# Altium schematic sheet QUTMS_CMU_type2_1_1.SchDoc
size B; DrawnBy: TTR
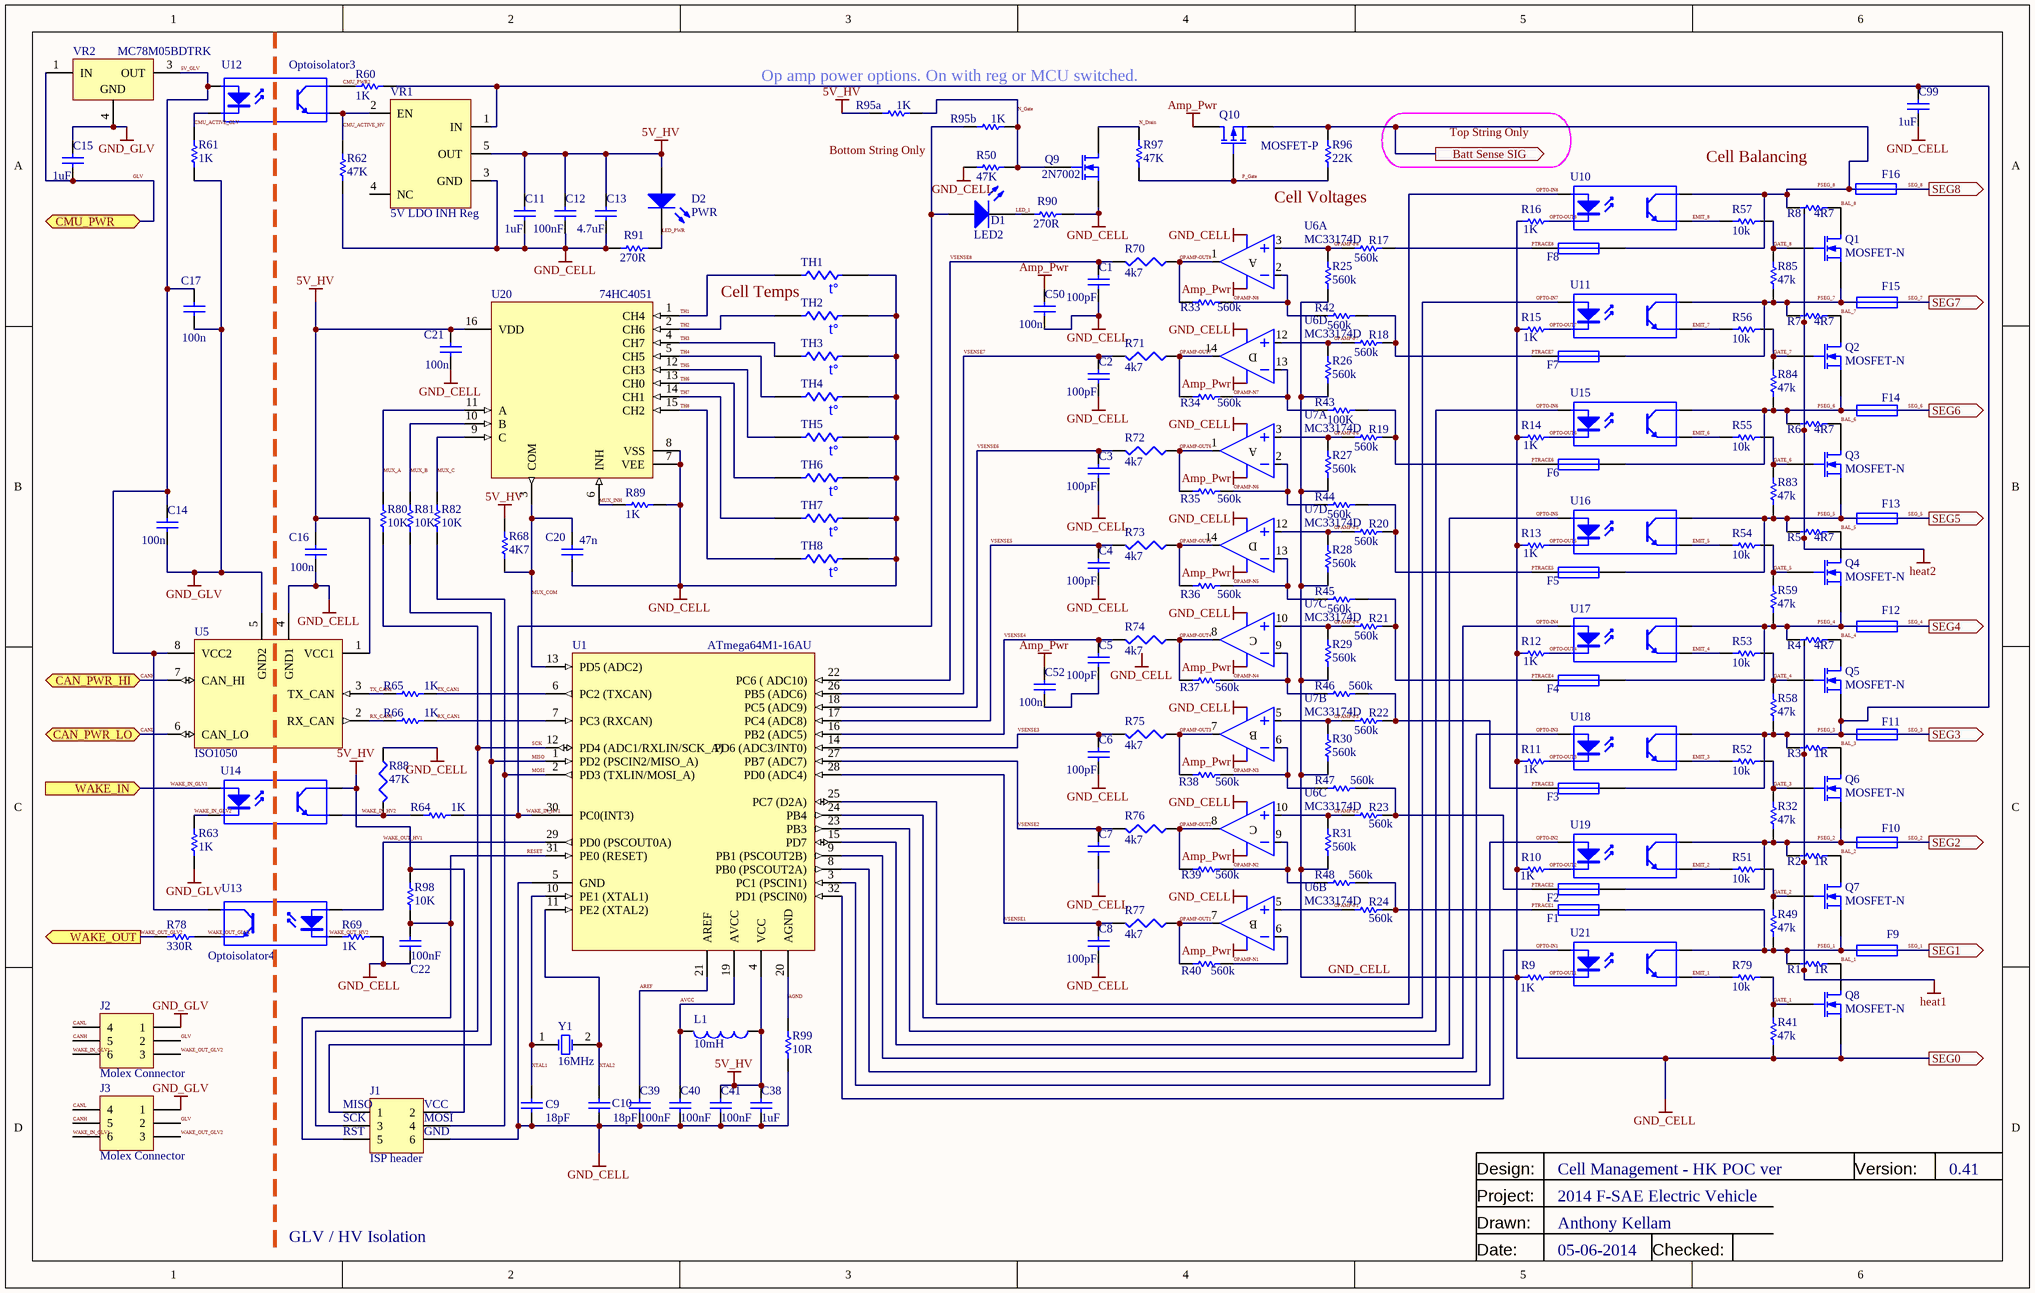
[diagram p0: QUTMS_CMU_type2_1_1.SchDoc]

## Parts
C1  100pF  [1608[0603]]
C2  100pF  [1608[0603]]
C3  100pF  [1608[0603]]
C4  100pF  [1608[0603]]
C5  100pF  [1608[0603]]
C6  100pF  [1608[0603]]
C7  100pF  [1608[0603]]  (value not drawn)
C8  100pF  [1608[0603]]
C9  18pF  [1608[0603]]
C10  18pF  [1608[0603]]
C11  1uF  [1608[0603]]
C12  100nF  [1608[0603]]
C13  4.7uF  [1608[0603]]
C14  value 100n  [1608[0603]]  (hidden comment: 100nF)
C15  value 1uF  [1608[0603]]  (hidden comment: 0603)
C16  value 100n  [1608[0603]]  (hidden comment: 100nF)
C17  value 100n  [1608[0603]]  (hidden comment: 100nF)
C20  value 47n  [1608[0603]]  (hidden comment: 0603)
C21  value 100n  [1608[0603]]  (hidden comment: 100nF)
C22  100nF  [1608[0603]]
C38  1uF  [1608[0603]]
C39  100nF  [1608[0603]]
C40  100nF  [1608[0603]]
C41  100nF  [1608[0603]]
C50  value 100n  [1608[0603]]  (hidden comment: 100nF)
C52  value 100n  [1608[0603]]  (hidden comment: 100nF)
C99  1uF  [1608[0603]]
D1  LED2  [2012[0805]_Res]
D2  PWR  [2012[0805]_Res]
F1  Fuse 1  [3216[1206]]  (value not drawn)
F2  Fuse 1  [3216[1206]]  (value not drawn)
F3  Fuse 1  [3216[1206]]  (value not drawn)
F4  Fuse 1  [3216[1206]]  (value not drawn)
F5  Fuse 1  [3216[1206]]  (value not drawn)
F6  Fuse 1  [3216[1206]]  (value not drawn)
F7  Fuse 1  [3216[1206]]  (value not drawn)
F8  Fuse 1  [3216[1206]]  (value not drawn)
F9  Fuse 1  [6426[2410]_Fuse]  (value not drawn)
F10  Fuse 1  [6426[2410]_Fuse]  (value not drawn)
F11  Fuse 1  [6426[2410]_Fuse]  (value not drawn)
F12  Fuse 1  [6426[2410]_Fuse]  (value not drawn)
F13  Fuse 1  [6426[2410]_Fuse]  (value not drawn)
F14  Fuse 1  [6426[2410]_Fuse]  (value not drawn)
F15  Fuse 1  [6426[2410]_Fuse]  (value not drawn)
F16  Fuse 1  [6426[2410]_Fuse]  (value not drawn)
J1  ISP header  [ISP Header]
J2  Molex Connector  [MOLEX_6H_2]
J3  Molex Connector  [MOLEX_6H_1]
L1  value 10mH  [2012[0805]_IND]  (hidden comment: 10uH)
Q1  MOSFET-N  [D2PAK_L]
Q2  MOSFET-N  [D2PAK_L]
Q3  MOSFET-N  [D2PAK_L]
Q4  MOSFET-N  [D2PAK_L]
Q5  MOSFET-N  [D2PAK_L]
Q6  MOSFET-N  [D2PAK_L]
Q7  MOSFET-N  [D2PAK_L]
Q8  MOSFET-N  [D2PAK_L]
Q9  2N7002  [SOT23_N]
Q10  MOSFET-P  [SOT23_N]
R1  value 1R  [D2PAK_N]  (hidden comment: 4R7)
R2  value 1R  [D2PAK_N]  (hidden comment: 4R7)
R3  value 1R  [D2PAK_N]  (hidden comment: 4R7)
R4  4R7  [D2PAK_N]
R5  4R7  [D2PAK_N]
R6  4R7  [D2PAK_N]
R7  4R7  [D2PAK_N]
R8  4R7  [D2PAK_N]
R9  1k  [2012[0805]_Res]
R10  1k  [2012[0805]_Res]
R11  1k  [2012[0805]_Res]
R12  1k  [2012[0805]_Res]
R13  1k  [2012[0805]_Res]
R14  1k  [2012[0805]_Res]
R15  1k  [2012[0805]_Res]
R16  1k  [2012[0805]_Res]
R17  560k  [2012[0805]_Res]
R18  560k  [2012[0805]_Res]
R19  560k  [2012[0805]_Res]
R20  560k  [2012[0805]_Res]
R21  560k  [2012[0805]_Res]
R22  560k  [2012[0805]_Res]
R23  560k  [2012[0805]_Res]
R24  560k  [2012[0805]_Res]
R25  560k  [2012[0805]_Res]
R26  560k  [2012[0805]_Res]
R27  560k  [2012[0805]_Res]
R28  560k  [2012[0805]_Res]
R29  560k  [2012[0805]_Res]
R30  560k  [2012[0805]_Res]
R31  560k  [2012[0805]_Res]
R32  47k  [2012[0805]_Res]
R33  560k  [2012[0805]_Res]
R34  560k  [2012[0805]_Res]
R35  560k  [2012[0805]_Res]
R36  560k  [2012[0805]_Res]
R37  560k  [2012[0805]_Res]
R38  560k  [2012[0805]_Res]
R39  560k  [2012[0805]_Res]
R40  560k  [2012[0805]_Res]
R41  47k  [2012[0805]_Res]
R42  560k  [2012[0805]_Res]
R43  value 100K  [2012[0805]_Res]  (hidden comment: 560k)
R44  560k  [2012[0805]_Res]
R45  560k  [2012[0805]_Res]
R46  560k  [2012[0805]_Res]
R47  560k  [2012[0805]_Res]
R48  560k  [2012[0805]_Res]
R49  47k  [2012[0805]_Res]
R50  47k  [2012[0805]_Res]
R51  10k  [2012[0805]_Res]
R52  10k  [2012[0805]_Res]
R53  10k  [2012[0805]_Res]
R54  10k  [2012[0805]_Res]
R55  10k  [2012[0805]_Res]
R56  10k  [2012[0805]_Res]
R57  10k  [2012[0805]_Res]
R58  47k  [2012[0805]_Res]
R59  47k  [2012[0805]_Res]
R60  1k  [2012[0805]_Res]
R61  1k  [2012[0805]_Res]
R62  47k  [2012[0805]_Res]
R63  1k  [2012[0805]_Res]
R64  1k  [2012[0805]_Res]
R65  1k  [2012[0805]_Res]
R66  1k  [2012[0805]_Res]
R68  4k7  [2012[0805]_Res]
R69  1k  [2012[0805]_Res]
R70  4k7  [2012[0805]_Res]
R71  4k7  [2012[0805]_Res]
R72  4k7  [2012[0805]_Res]
R73  4k7  [2012[0805]_Res]
R74  4k7  [2012[0805]_Res]
R75  4k7  [2012[0805]_Res]
R76  4k7  [2012[0805]_Res]
R77  4k7  [2012[0805]_Res]
R78  330R  [2012[0805]_Res]
R79  10k  [2012[0805]_Res]
R80  10k  [2012[0805]_Res]
R81  10k  [2012[0805]_Res]
R82  10k  [2012[0805]_Res]
R83  47k  [2012[0805]_Res]
R84  47k  [2012[0805]_Res]
R85  47k  [2012[0805]_Res]
R88  47k  [2012[0805]_Res]
R89  value 1K  [2012[0805]_Res]  (hidden comment: 0805)
R90  270R  [2012[0805]_Res]
R91  270R  [2012[0805]_Res]
R95a  value 1K  [2012[0805]_Res]  (hidden comment: 10k)
R95b  value 1K  [2012[0805]_Res]  (hidden comment: 10k)
R96  22k  [2012[0805]_Res]
R97  47k  [2012[0805]_Res]
R98  10k  [2012[0805]_Res]
R99  10R  [2012[0805]_Res]
TH1  Res Thermal  [HDR1X2]  (value not drawn)
TH2  Res Thermal  [HDR1X2]  (value not drawn)
TH3  Res Thermal  [HDR1X2]  (value not drawn)
TH4  Res Thermal  [HDR1X2]  (value not drawn)
TH5  Res Thermal  [HDR1X2]  (value not drawn)
TH6  Res Thermal  [HDR1X2]  (value not drawn)
TH7  Res Thermal  [HDR1X2]  (value not drawn)
TH8  Res Thermal  [HDR1X2]  (value not drawn)
U1  ATmega64M1-16AU  [32A_N]
U5  ISO1050  [DUB8]
U6  MC33174D  [SO14_N]  (parts A,B,C,D of 4)
U7  MC33174D  [SO14_N]  (parts A,B,C,D of 4)
U10  Optoisolator1  [SO4]  (value not drawn)
U11  Optoisolator1  [SO4]  (value not drawn)
U12  Optoisolator3  [SO4]
U13  Optoisolator4  [SO4]
U14  Optoisolator1  [SO4]  (value not drawn)
U15  Optoisolator1  [SO4]  (value not drawn)
U16  Optoisolator1  [SO4]  (value not drawn)
U17  Optoisolator1  [SO4]  (value not drawn)
U18  Optoisolator1  [SO4]  (value not drawn)
U19  Optoisolator1  [SO4]  (value not drawn)
U20  74HC4051  [SO-16]
U21  Optoisolator1  [SO4]  (value not drawn)
VR1  5V LDO INH Reg  [DPAK-5]
VR2  MC78M05BDTRK  [D2PAK]
Y1  16MHz  [Crystal]

## Ports
Batt Sense SIG, CAN_PWR_HI (bidir), CAN_PWR_LO (bidir), CMU_PWR, SEG0 (out), SEG1 (out), SEG2 (out), SEG3 (out), SEG4 (out), SEG5 (out), SEG6 (out), SEG7 (out), SEG8 (out), WAKE_IN (in), WAKE_OUT (out)

## Nets
5V_HV: C11.2 C12.2 C13.2 C16.2 C21.2 C38.1 C41.1 D2.1(A) J1.2 L1.1 R68.2 R95a.1 R98.2 U1.4(VCC) U5.1(VCC1) U14.4(C) U20.16(VDD) VR1.5(OUT)
Amp_Pwr: C50.2 C52.2 Q10.3(D) U6.4(V+) U7.4(V+)
GND_CELL: C1.1 C2.1 C3.1 C4.1 C6.1 C7.1 C8.1 C9.1 C10.1 C11.1 C12.1 C13.1 C16.1 C20.1 C21.1 C22.1 C38.2 C39.2 C40.2 C41.2 C50.1 C99.1 J1.6 Q8.3(S) Q9.2(S) R9.1 R10.1 R11.1 R12.1 R13.1 R14.1 R15.1 R16.1 R25.2 R26.2 R27.2 R28.2 R29.2 R30.2 R31.2 R41.1 R50.1 R62.2 R69.1 R88.1 R89.2 R90.1 R91.2 R99.1 TH1.1 TH2.1 TH3.1 TH4.1 TH5.1 TH6.1 TH7.1 TH8.1 U1.5(GND) U5.4(GND1) U6.11(V-) U7.11(V-) U20.7(VEE) U20.8(VSS) VR1.3(GND) ; port SEG0
GND_GLV: C14.1 C15.2 C17.1 J2.1 J3.1 R61.2 R63.2 U5.5(GND2) VR2.4(GND)
heat1: R1.2(Heat) R2.2(Heat) R3.2(Heat) R4.2(Heat)
heat2: R5.2(Heat) R6.2(Heat) R7.2(Heat) R8.2(Heat)
5V_GLV: C14.2 C17.2 U5.8(VCC2) U12.1(A) U13.4(C) VR2.3(OUT)
AGND: R99.2 U1.20(AGND)
AREF: C39.1 U1.21(AREF)
AVCC: C40.1 L1.2 U1.19(AVCC)
BAL_1: Q8.2(D) R1.3
BAL_2: Q7.2(D) R2.3
BAL_3: Q6.2(D) R3.3
BAL_4: Q5.2(D) R4.3
BAL_5: Q4.2(D) R5.3
BAL_6: Q3.2(D) R6.3
BAL_7: Q2.2(D) R7.3
BAL_8: Q1.2(D) R8.3
CANH: J2.5 J3.5 U5.7(CAN_HI) ; port CAN_PWR_HI
CANL: J2.4 J3.4 U5.6(CAN_LO) ; port CAN_PWR_LO
CMU_ACTIVE_GLV: R61.1 U12.2(K)
CMU_ACTIVE_HV: R62.1 U12.3(E) VR1.2(EN)
CMU_PWR2: R60.1 U12.4(C)
EMIT_1: R79.2 U21.3(E)
EMIT_2: R51.2 U19.3(E)
EMIT_3: R52.2 U18.3(E)
EMIT_4: R53.2 U17.3(E)
EMIT_5: R54.2 U16.3(E)
EMIT_6: R55.2 U15.3(E)
EMIT_7: R56.2 U11.3(E)
EMIT_8: R57.2 U10.3(E)
GATE_1: Q8.1(G) R41.2 R79.1
GATE_2: Q7.1(G) R49.2 R51.1
GATE_3: Q6.1(G) R32.2 R52.1
GATE_4: Q5.1(G) R53.1 R58.1
GATE_5: Q4.1(G) R54.1 R59.2
GATE_6: Q3.1(G) R55.1 R83.2
GATE_7: Q2.1(G) R56.1 R84.2
GATE_8: Q1.1(G) R57.1 R85.2
GLV: C15.1 J2.2 J3.2 VR2.1(IN) ; port CMU_PWR
LED_1: D1.2(K) R90.2
LED_PWR: D2.2(K) R91.1
MISO: J1.1 R81.1 U1.1(PD2_(PSCIN2/MISO_A))
MOSI: J1.4 R82.1 U1.2(PD3_(TXLIN/MOSI_A))
MUX_A: R80.2 U20.11(A)
MUX_B: R81.2 U20.10(B)
MUX_C: R82.2 U20.9(C)
MUX_COM: C20.2 R68.1 U1.13(PD5_(ADC2)) U20.3(COM)
MUX_INH: R89.1 U20.6(INH)
N_Drain: Q9.3(D) R97.1
N_Gate: Q9.1(G) R50.2 R95a.2 R95b.2
OPAMP-N1: R40.1 U6.6(IN-)
OPAMP-N2: R39.1 R48.2 U6.9(IN-)
OPAMP-N3: R38.1 R47.2 U7.6(IN-)
OPAMP-N4: R37.1 R46.2 U7.9(IN-)
OPAMP-N5: R36.1 R45.2 U7.13(IN-)
OPAMP-N6: R35.1 R44.2 U7.2(IN-)
OPAMP-N7: R34.1 R43.2 U6.13(IN-)
OPAMP-N8: R33.1 R42.2 U6.2(IN-)
OPAMP-OUT1: R40.2 R77.1 U6.7(OUT)
OPAMP-OUT2: R39.2 R76.1 U6.8(OUT)
OPAMP-OUT3: R38.2 R75.1 U7.7(OUT)
OPAMP-OUT4: R37.2 R74.1 U7.8(OUT)
OPAMP-OUT5: R36.2 R73.1 U7.14(OUT)
OPAMP-OUT6: R35.2 R72.1 U7.1(OUT)
OPAMP-OUT7: R34.2 R71.1 U6.14(OUT)
OPAMP-OUT8: R33.2 R70.1 U6.1(OUT)
OPAMP-P1: R24.2 U6.5(IN+)
OPAMP-P2: R23.2 R31.1 U6.10(IN+)
OPAMP-P3: R22.2 R30.1 U7.5(IN+)
OPAMP-P4: R21.2 R29.1 U7.10(IN+)
OPAMP-P5: R20.2 R28.1 U7.12(IN+)
OPAMP-P6: R19.2 R27.1 U7.3(IN+)
OPAMP-P7: R18.2 R26.1 U6.12(IN+)
OPAMP-P8: R17.2 R25.1 U6.3(IN+)
OPTO-IN1: U1.32(PD1_(PSCIN0)) U21.1(A)
OPTO-IN2: U1.3(PC1_(PSCIN1)) U19.1(A)
OPTO-IN3: U1.8(PB0_(PSCOUT2A)) U18.1(A)
OPTO-IN4: U1.9(PB1_(PSCOUT2B)) U17.1(A)
OPTO-IN5: U1.15(PD7) U16.1(A)
OPTO-IN6: U1.23(PB3) U15.1(A)
OPTO-IN7: U1.24(PB4) U11.1(A)
OPTO-IN8: U1.25(PC7_(D2A)) U10.1(A)
OPTO-OUT1: R9.2 U21.2(K)
OPTO-OUT2: R10.2 U19.2(K)
OPTO-OUT3: R11.2 U18.2(K)
OPTO-OUT4: R12.2 U17.2(K)
OPTO-OUT5: R13.2 U16.2(K)
OPTO-OUT6: R14.2 U15.2(K)
OPTO-OUT7: R15.2 U11.2(K)
OPTO-OUT8: R16.2 U10.2(K)
P_Gate: Q10.1(G) R96.2 R97.2
PSEG_1: F1.2 F9.1 Q7.3(S) R1.1 R49.1 U21.4(C)
PSEG_2: F2.2 F10.1 Q6.3(S) R2.1 R32.1 U19.4(C)
PSEG_3: C99.2 F3.2 F11.1 Q5.3(S) R3.1 R58.2 R60.2 U18.4(C) VR1.1(IN)
PSEG_4: F4.2 F12.1 Q4.3(S) R4.1 R59.1 U17.4(C)
PSEG_5: F5.2 F13.1 Q3.3(S) R5.1 R83.1 U16.4(C)
PSEG_6: F6.2 F14.1 Q2.3(S) R6.1 R84.1 U15.4(C)
PSEG_7: F7.2 F15.1 Q1.3(S) R7.1 R85.1 U11.4(C)
PSEG_8: F8.2 F16.1 Q10.2(S) R8.1 R96.1 U10.4(C) ; port Batt Sense SIG
PTRACE1: F1.1 R24.1 R48.1
PTRACE2: F2.1 R23.1 R47.1
PTRACE3: F3.1 R22.1 R46.1
PTRACE4: F4.1 R21.1 R45.1
PTRACE5: F5.1 R20.1 R44.1
PTRACE6: F6.1 R19.1 R43.1
PTRACE7: F7.1 R18.1 R42.1
PTRACE8: F8.1 R17.1
RESET: C22.2 J1.5 R98.1 U1.31(PE0_(RESET))
RX_CAN1: R66.2 U1.7(PC3_(RXCAN))
RX_CAN2: R66.1 U5.2(RX_CAN)
SCK: J1.3 R80.1 U1.12(PD4_(ADC1/RXLIN/SCK_A))
SEG_1: F9.2 ; port SEG1
SEG_2: F10.2 ; port SEG2
SEG_3: F11.2 ; port SEG3
SEG_4: F12.2 ; port SEG4
SEG_5: F13.2 ; port SEG5
SEG_6: F14.2 ; port SEG6
SEG_7: F15.2 ; port SEG7
SEG_8: F16.2 ; port SEG8
TH1: TH1.2 U20.1(CH4)
TH2: TH2.2 U20.2(CH6)
TH3: TH3.2 U20.4(CH7)
TH4: TH4.2 U20.5(CH5)
TH5: TH5.2 U20.12(CH3)
TH6: TH6.2 U20.13(CH0)
TH7: TH7.2 U20.14(CH1)
TH8: TH8.2 U20.15(CH2)
TX_CAN1: R65.2 U1.6(PC2_(TXCAN))
TX_CAN2: R65.1 U5.3(TX_CAN)
VSENSE1: C8.2 R77.2 U1.28(PD0_(ADC4))
VSENSE2: C7.2 R76.2 U1.27(PB7_(ADC7))
VSENSE3: C6.2 R75.2 U1.14(PD6_(ADC3/INT0))
VSENSE4: C5.2 R74.2 U1.16(PB2_(ADC5))
VSENSE5: C4.2 R73.2 U1.17(PC4_(ADC8))
VSENSE6: C3.2 R72.2 U1.18(PC5_(ADC9))
VSENSE7: C2.2 R71.2 U1.26(PB5_(ADC6))
VSENSE8: C1.2 R70.2 U1.22(PC6_(_ADC10))
WAKE_IN_GLV1: J2.6 J3.6 U14.1(A) ; port WAKE_IN
WAKE_IN_GLV2: R63.1 U14.2(K)
WAKE_IN_HV1: D1.1(A) R64.2 R95b.1 U1.30(PC0(INT3))
WAKE_IN_HV2: R64.1 R88.2 U14.3(E)
WAKE_OUT_GLV1: R78.1 U13.3(E)
WAKE_OUT_GLV2: J2.3 J3.3 R78.2 ; port WAKE_OUT
WAKE_OUT_HV1: U1.29(PD0_(PSCOUT0A)) U13.1(A)
WAKE_OUT_HV2: R69.2 U13.2(K)
XTAL1: C9.2 U1.10(PE1_(XTAL1)) Y1.1(OSC1)
XTAL2: C10.2 U1.11(PE2_(XTAL2)) Y1.2(OSC2)
NetC5_1: C5.1 C52.1

Not connected (* = marked no-connect by the designer): VR1 4(NC)

## Notes on the sheet
- Op amp power options. On with reg or MCU switched.
- Bottom String Only
- Top String Only
- Cell Balancing
- Cell Voltages
- Cell Temps
- (near J1) MISO
- (near J1) VCC
- (near J1) SCK
- (near J1) RST
- (near J1) MOSI
- (near J1) GND
- Design:
- Cell Management - HK POC ver
- Version:
- 0.41
- GLV / HV Isolation
- Project:
- Drawn:
- 2014 F-SAE Electric Vehicle
- Anthony Kellam
- Date:
- 05-06-2014
- Checked:
- Labels drawn without touching a wire or pin: GND_CELL
- (in symbol MC33174D, part A) A
- (in symbol MC33174D, part B) B
- (in symbol MC33174D, part C) C
- (in symbol MC33174D, part D) D
- (in symbol Res Thermal) t°

## Library data of the parts
C1-C8 = Cap Semi: 0603; Manufacturer: Samsung Electro-Mechanics America, Inc.; Manufacturer Part Number: CL10B101KB8NNNC; Tolerance: ±10%; Voltage - Rated: 50V; Temperature Coefficient: X7R; Published: 8-Jun-2000; LatestRevisionDate: 17-Jul-2002; LatestRevisionNote: Re-released for DXP Platform.; PackageReference: C1206; Publisher: Altium Limited; Supplier 1: Digi-Key; RoHS: RoHS Compliant; Category: Capacitors; Stock 1: 69412; Pricing 1: 1=0.14, 10=0.043, 25=0.0304, 50=0.0236, 100=0.0198, 500=0.01386, 1000=0.01079 (AUD); Packaging: Cut Tape (CT); Capacitance: 100pF; Mounting Type: Surface Mount, MLCC; Operating Temperature: -55°C ~ 125°C; Applications: General Purpose; Ratings: -; Package / Case: 0603 (1608 Metric); Size / Dimension: 0.063" L x 0.031" W (1.60mm x 0.80mm); Height - Seated (Max): -; Thickness (Max): 0.035" (0.90mm); Lead Spacing: -; Features: -; Lead Style: -; ComponentLink1URL: http://www.samsungsem.com/kr/support/product-search/mlcc/CL10B101KB8NNNC.jsp; ComponentLink1Description: http://www.samsungsem.com/kr/support/product-search/mlcc/CL10B101KB8NNNC.jsp
  C1-C6 C8: Value: 100pF
C9-C11 C13 C38 C99 = Cap Semi: 0603; Published: 8-Jun-2000; LatestRevisionDate: 17-Jul-2002; LatestRevisionNote: Re-released for DXP Platform.; PackageReference: C1206; Publisher: Altium Limited
  C9 C10: Value: 18pF
  C11 C38 C99: Value: 1uF
  C13: Value: 4.7uF
C12 C14 C16 C17 C21 C22 C39-C41 C50 C52 = Cap Semi: 0603; Manufacturer: Samsung Electro-Mechanics America, Inc.; Manufacturer Part Number: CL10B104KB8SFNC; Capacitance: 0.10µF; Tolerance: ±10%; Voltage - Rated: 50V; Temperature Coefficient: X7R; Published: 8-Jun-2000; LatestRevisionDate: 17-Jul-2002; LatestRevisionNote: Re-released for DXP Platform.; PackageReference: C1206; Publisher: Altium Limited; Supplier 1: Digi-Key; RoHS: RoHS Compliant; Category: Capacitors; Stock 1: 2637354; Pricing 1: 1=0.14, 10=0.028, 25=0.02, 50=0.0152, 100=0.0123, 250=0.01036, 500=0.00882, 1000=0.00693 (AUD); Packaging: Cut Tape (CT); Mounting Type: Surface Mount, MLCC; Operating Temperature: -55°C ~ 125°C; Applications: Boardflex Sensitive; Ratings: -; Package / Case: 0603 (1608 Metric); Size / Dimension: 0.063" L x 0.031" W (1.60mm x 0.80mm); Height - Seated (Max): -; Thickness (Max): 0.035" (0.90mm); Lead Spacing: -; Features: Soft Termination; Lead Style: -; ComponentLink1URL: http://www.samsungsem.com/kr/support/product-search/mlcc/CL10B104KB8SFNC.jsp; ComponentLink1Description: http://www.samsungsem.com/kr/support/product-search/mlcc/CL10B104KB8SFNC.jsp
  C12 C22 C39-C41: Value: 100nF
C15 = Cap Semi: 1uF; Published: 8-Jun-2000; LatestRevisionDate: 17-Jul-2002; LatestRevisionNote: Re-released for DXP Platform.; PackageReference: C1206; Publisher: Altium Limited
C20 = Cap Semi: 47nF; Published: 8-Jun-2000; LatestRevisionDate: 17-Jul-2002; LatestRevisionNote: Re-released for DXP Platform.; PackageReference: C1206; Publisher: Altium Limited
D1 = LED2: Typical RED, GREEN, YELLOW, AMBER GaAs LED; Manufacturer: Kingbright; Manufacturer Part Number: APT2012SGC; Lens Color: Colorless; Lens Transparency: Clear; Millicandela Rating: 12mcd; Lens Style/Size: Rectangle with Flat Top, 1.30mm x 1.25mm; Voltage - Forward (Vf) (Typ): 2.2V; Current - Test: 20mA; Viewing Angle: 120°; Wavelength - Dominant: 568nm; Wavelength - Peak: 565nm; Published: 8-Jun-2000; LatestRevisionDate: 17-Jul-2002; LatestRevisionNote: Re-released for DXP Platform.; PackageVersion: Feb-2002; PackageReference: 3.2X1.6X1.1; Publisher: Altium Limited; PackageDescription: SM LED; 2 Flat Leads; Supplier 1: Digi-Key; RoHS: RoHS Compliant; Category: Optoelectronics; Stock 1: 121930; Pricing 1: 1=0.54, 10=0.39, 25=0.2876, 100=0.2054, 250=0.13972, 500=0.12324, 1000=0.09655 (AUD); Packaging: Cut Tape (CT); Color: Green; Mounting Type: Surface Mount; Features: -; Package / Case: 0805 (2012 Metric); Supplier Device Package: Chip LED; Size / Dimension: 2.00mm L x 1.25mm W; Height (Max): 0.75mm; ComponentLink1URL: http://www.kingbrightusa.com/images/catalog/SPEC/APT2012SGC.pdf; ComponentLink1Description: http://www.kingbrightusa.com/images/catalog/SPEC/APT2012SGC.pdf
D2 = LED2: Typical RED, GREEN, YELLOW, AMBER GaAs LED; Manufacturer: OSRAM Opto Semiconductors Inc.; Manufacturer Part Number: LS R976-NR-1; Lens Color: White; Lens Transparency: Diffused; Millicandela Rating: 104mcd; Lens Style/Size: Rectangle with Flat Top, 1.30mm x 1.25mm; Voltage - Forward (Vf) (Typ): 2V; Current - Test: 20mA; Viewing Angle: 160°; Wavelength - Dominant: 633nm; Wavelength - Peak: 645nm; Published: 8-Jun-2000; LatestRevisionDate: 17-Jul-2002; LatestRevisionNote: Re-released for DXP Platform.; PackageVersion: Feb-2002; PackageReference: 3.2X1.6X1.1; Publisher: Altium Limited; PackageDescription: SM LED; 2 Flat Leads; Supplier 1: Digi-Key; RoHS: RoHS Compliant; Category: Optoelectronics; Stock 1: 283435; Pricing 1: 1=0.37, 10=0.274, 25=0.202, 100=0.1444, 250=0.09816, 500=0.08662, 1000=0.06785 (AUD); Packaging: Cut Tape (CT); Color: Red; Mounting Type: Surface Mount; Features: -; Package / Case: 0805 (2012 Metric); Supplier Device Package: *; Size / Dimension: 2.00mm L x 1.25mm W; Height (Max): 0.90mm; ComponentLink1URL: http://www.osram-os.com/Graphics/XPic8/00078896_0.pdf; ComponentLink1Description: http://www.osram-os.com/Graphics/XPic8/00078896_0.pdf
F1-F8 = Fuse 1: Fuse; Manufacturer: Schurter Inc.; Manufacturer Part Number: 3413.0008.22; Fuse Type: Board Mount (Cartridge Style Excluded); Current Rating: 160mA; Voltage Rating - AC: 125V; Voltage Rating - DC: 63V; Response Time: Fast; Breaking Capacity @ Rated Voltage: 100A; Melting I²t: 0.0015; Approvals: cURus; DC Cold Resistance: 0.51 Ohm; Published: 8-Jun-2000; LatestRevisionDate: 17-Jul-2002; LatestRevisionNote: Re-released for DXP Platform.; PackageReference: PIN-W2/E2.8; Publisher: Altium Limited; PackageDescription: Thru-Hole; 2 Leads; Supplier 1: Digi-Key; RoHS: RoHS Compliant; Category: Circuit Protection; Stock 1: 11133; Pricing 1: 1=0.79, 50=0.5616, 100=0.5303, 250=0.49916, 500=0.46796 (AUD); Packaging: Cut Tape (CT); Package / Case: 1206 (3216 Metric); Mounting Type: Surface Mount; Operating Temperature: -55°C ~ 90°C; Color: -; Size / Dimension: 0.126" L x 0.063" W x 0.063" H (3.20mm x 1.60mm x 1.60mm); ComponentLink1URL: http://www.schurterinc.com/bundles/snceschurter/epim/_ProdPool_/newDS/en/typ_USFF_1206.pdf; ComponentLink1Description: http://www.schurterinc.com/bundles/snceschurter/epim/_ProdPool_/newDS/en/typ_USFF_1206.pdf
F9-F16 = Fuse 1: Fuse; Manufacturer: Bel Fuse Inc.; Manufacturer Part Number: 0679L5000-05; Fuse Type: Board Mount (Cartridge Style Excluded); Current Rating: 5A; Voltage Rating - AC: 125V; Response Time: Fast; Breaking Capacity @ Rated Voltage: 50A AC, 300A DC; Melting I²t: 5.5; Approvals: cURus; DC Cold Resistance: 0.014 Ohm; Published: 8-Jun-2000; LatestRevisionDate: 17-Jul-2002; LatestRevisionNote: Re-released for DXP Platform.; PackageReference: PIN-W2/E2.8; Publisher: Altium Limited; PackageDescription: Thru-Hole; 2 Leads; Supplier 1: Digi-Key; RoHS: RoHS Compliant; Category: Circuit Protection; Stock 1: 9943; Pricing 1: 1=0.49, 10=0.458, 25=0.4224, 100=0.3796, 250=0.33808, 500=0.28172, 1000=0.26696, 2500=0.23879 (AUD); Packaging: Cut Tape (CT); Voltage Rating - DC: 125V; Package / Case: 2410 (6125 Metric); Mounting Type: Surface Mount; Operating Temperature: -55°C ~ 125°C; Color: -; Size / Dimension: 0.240" L x 0.100" W x 0.110" H (6.10mm x 2.54mm x 2.79mm); ComponentLink1URL: http://belfuse.com/pdfs/0679L.pdf; ComponentLink1Description: http://belfuse.com/pdfs/0679L.pdf
J1 = Header 3X2: Header, 3-Pin, Dual row; Manufacturer: Amphenol FCI; Manufacturer Part Number: 95278-101A06LF; Connector Type: Header, Unshrouded; Number of Positions: 6; Number of Positions Loaded: All; Pitch: 0.100" (2.54mm); LatestRevisionDate: 17-Jul-2002; LatestRevisionNote: Re-released for DXP Platform.; Publisher: Altium Limited; Supplier 1: Digi-Key; RoHS: RoHS Compliant; Category: Connectors, Interconnects; Stock 1: 20867; Pricing 1: 1=1.46, 10=1.283, 25=1.208, 50=1.1578, 100=1.1073 (AUD); Packaging: Cut Tape (CT); Contact Type: Male Pin; Number of Rows: 2; Row Spacing: 0.100" (2.54mm); Contact Mating Length: 0.232" (5.90mm); Mounting Type: Surface Mount; Termination: Solder; Fastening Type: -; Features: -; Contact Finish: Gold, GXT™; Contact Finish Thickness: 30µin (0.76µm); Color: Black; ComponentLink1URL: http://portal.fciconnect.com/Comergent//fci/drawing/95278.pdf; ComponentLink1Description: http://portal.fciconnect.com/Comergent//fci/drawing/95278.pdf
J2 J3 = Header 3X2A: Header, 3-Pin, Dual row; Manufacturer: Molex, LLC; Manufacturer Part Number: 0430450610; Connector Type: Header, Shrouded; Number of Positions: 6; Number of Positions Loaded: All; Pitch: 0.118" (3.00mm); LatestRevisionDate: 17-Jul-2002; LatestRevisionNote: Re-released for DXP Platform.; Publisher: Altium Limited; Supplier 1: Digi-Key; RoHS: RoHS Compliant; Category: Connectors, Interconnects; Stock 1: 3380; Pricing 1: 1=4.47, 10=4.292, 25=3.934, 50=3.7552, 100=3.5761 (AUD); Packaging: Cut Tape (CT); Contact Type: Male Pin; Number of Rows: 2; Row Spacing: 0.118" (3.00mm); Contact Mating Length: -; Mounting Type: Surface Mount, Right Angle; Termination: Solder; Fastening Type: Locking Ramp; Features: Solder Retention; Contact Finish: Gold; Contact Finish Thickness: 15µin (0.38µm); Color: Black; ComponentLink1URL: http://www.molex.com/pdm_docs/sd/430450610_sd.pdf; ComponentLink1Description: http://www.molex.com/pdm_docs/sd/430450610_sd.pdf
L1 = Inductor: 0805; Code_IEC: 1005; Published: 8-Jun-2000; LatestRevisionDate: 17-Jul-2002; LatestRevisionNote: Re-released for DXP Platform.; PackageReference: 0402-A; Publisher: Altium Limited; Code_JEITA: 0402
Q1-Q8 = MOSFET-N: N-Channel MOSFET; Manufacturer: Fairchild Semiconductor; Manufacturer Part Number: FDD86250; FET Type: MOSFET N-Channel, Metal Oxide; FET Feature: Standard; Drain to Source Voltage (Vdss): 150V; Current - Continuous Drain (Id) @ 25°C: 8A (Ta), 50A (Tc); Rds On (Max) @ Id, Vgs: 22 mOhm @ 8A, 10V; Vgs(th) (Max) @ Id: 4V @ 250µA; Gate Charge (Qg) @ Vgs: 33nC @ 10V; Input Capacitance (Ciss) @ Vds: 2110pF @ 75V; Power - Max: 3.1W; Transistor Type: NPN - Darlington; Current - Collector (Ic) (Max): 8A; Voltage - Collector Emitter Breakdown (Max): 100V; Vce Saturation (Max) @ Ib, Ic: 4V @ 80mA, 8A; Current - Collector Cutoff (Max): 10µA; DC Current Gain (hFE) (Min) @ Ic, Vce: 1000 @ 4A, 4V; Frequency - Transition: 4MHz; Published: 8-Jun-2000; LatestRevisionDate: 17-Jul-2002; LatestRevisionNote: Re-released for DXP Platform.; PackageVersion: 1995/1996; PackageReference: E3; Publisher: Altium Limited; PackageDescription: TO, Flat Index; 3 In-Line, Axial Leads; Body Dia. 4.6mm; Lead Dia. 0.5 mm (max); Supplier 1: Digi-Key; RoHS: RoHS Compliant; Category: Discrete Semiconductor Products; Stock 1: 4107; Pricing 1: 1=2.1, 10=1.888, 100=1.5146, 500=1.24488, 1000=1.03048 (AUD); Packaging: Cut Tape (CT); Operating Temperature: -55°C ~ 150°C (TJ); Mounting Type: Surface Mount; Package / Case: TO-252-3, DPak (2 Leads + Tab), SC-63; Supplier Device Package: TO-252, (D-Pak); ComponentLink1URL: http://www.fairchildsemi.com/datasheets/FD/FDD86250.pdf; ComponentLink1Description: http://www.fairchildsemi.com/datasheets/FD/FDD86250.pdf; Supplier 2: Digi-Key; Stock 2: 8146; Pricing 2: 1=0.8, 10=0.686, 100=0.5121, 500=0.4022, 1000=0.31009 (AUD); ComponentLink2URL: http://www.onsemi.com/pub_link/Collateral/MJD122-D.PDF; ComponentLink2Description: http://www.onsemi.com/pub_link/Collateral/MJD122-D.PDF
Q9 = MOSFET-N: N-Channel MOSFET; Manufacturer: NXP Semiconductors; Manufacturer Part Number: 2N7002P,215; PackageDocument: 1995/1996; FET Type: MOSFET N-Channel, Metal Oxide; FET Feature: Logic Level Gate; Drain to Source Voltage (Vdss): 60V; Current - Continuous Drain (Id) @ 25°C: 360mA (Ta); Rds On (Max) @ Id, Vgs: 1.6 Ohm @ 500mA, 10V; Vgs(th) (Max) @ Id: 2.4V @ 250µA; Gate Charge (Qg) @ Vgs: 0.8nC @ 4.5V; Input Capacitance (Ciss) @ Vds: 50pF @ 10V; Power - Max: 350mW; Published: 8-Jun-2000; LatestRevisionDate: 17-Jul-2002; LatestRevisionNote: Re-released for DXP Platform.; PackageReference: E3; Publisher: Altium Limited; Supplier 1: Digi-Key; RoHS: RoHS Compliant; Category: Discrete Semiconductor Products; Stock 1: 319890; Pricing 1: 1=0.19, 10=0.177, 100=0.0968, 500=0.05954, 1000=0.04061 (AUD); Packaging: Cut Tape (CT); Operating Temperature: -55°C ~ 150°C (TJ); Mounting Type: Surface Mount; Package / Case: TO-236-3, SC-59, SOT-23-3; Supplier Device Package: SOT-23 (TO-236AB); ComponentLink1URL: http://www.nxp.com/documents/data_sheet/2N7002P.pdf; ComponentLink1Description: http://www.nxp.com/documents/data_sheet/2N7002P.pdf
Q10 = MOSFET-P: P-Channel MOSFET; Manufacturer: Vishay Siliconix; Manufacturer Part Number: TP0610K-T1-GE3; PackageDocument: 1995/1996; FET Type: MOSFET P-Channel, Metal Oxide; FET Feature: Standard; Drain to Source Voltage (Vdss): 60V; Current - Continuous Drain (Id) @ 25°C: 185mA (Ta); Rds On (Max) @ Id, Vgs: 6 Ohm @ 500mA, 10V; Vgs(th) (Max) @ Id: 3V @ 250µA; Gate Charge (Qg) @ Vgs: 1.7nC @ 15V; Input Capacitance (Ciss) @ Vds: 23pF @ 25V; Power - Max: 350mW; Published: 8-Jun-2000; LatestRevisionDate: 17-Jul-2002; LatestRevisionNote: Re-released for DXP Platform.; PackageReference: E3; Publisher: Altium Limited; Supplier 1: Digi-Key; RoHS: RoHS Compliant; Category: Discrete Semiconductor Products; Stock 1: 18760; Pricing 1: 1=0.5, 10=0.401, 25=0.3672, 100=0.2736, 250=0.24792, 500=0.20516, 1000=0.15387 (AUD); Packaging: Cut Tape (CT); Operating Temperature: -55°C ~ 150°C (TJ); Mounting Type: Surface Mount; Package / Case: TO-236-3, SC-59, SOT-23-3; Supplier Device Package: SOT-23-3 (TO-236); ComponentLink1URL: http://www.vishay.com/docs/71411/tp0610k.pdf; ComponentLink1Description: http://www.vishay.com/docs/71411/tp0610k.pdf
R1-R8 = Res1: Power Resistor SMD; Manufacturer: Bourns Inc.; Manufacturer Part Number: PWR163S-25-1R00J; Resistance (Ohms): 1; Tolerance: ±5%; Power (Watts): 25W; Temperature Coefficient: ±100ppm/°C; Published: 8-Jun-2000; LatestRevisionDate: 17-Jul-2002; LatestRevisionNote: Re-released for DXP Platform.; PackageReference: AXIAL-0.3; Publisher: Altium Limited; Supplier 1: Digi-Key; RoHS: RoHS Compliant; Category: Resistors; Stock 1: 254; Pricing 1: 1=3.71, 10=3.283, 25=3.0432, 50=2.8642, 100=2.5061, 250=2.14812, 500=1.7901, 1000=1.55142, 2500=1.52159 (AUD); Packaging: Tube; Composition: Thick Film; Features: Automotive AEC-Q200, Current Sense, Pulse Withstanding; Operating Temperature: -55°C ~ 155°C; Package / Case: TO-252-3, DPak (2 Leads + Tab), SC-63; Supplier Device Package: DPAK; Size / Dimension: 0.320" L x 0.324" W (8.13mm x 8.22mm); Height: 0.110" (2.79mm); Number of Terminations: 2; ComponentLink1URL: http://www.bourns.com/docs/Product-Datasheets/PWR163.pdf; ComponentLink1Description: http://www.bourns.com/docs/Product-Datasheets/PWR163.pdf
  R4-R8: Value: 4R7
R9-R16 R50 R60-R66 R68 R69 R78 R80-R82 R90 R91 R95a R95b R96-R99 = Res1: 0805; Published: 8-Jun-2000; LatestRevisionDate: 17-Jul-2002; LatestRevisionNote: Re-released for DXP Platform.; PackageReference: AXIAL-0.3; Publisher: Altium Limited
  R9-R16 R60 R61 R63-R66 R69: Value: 1K
  R50 R62 R97: Value: 47K
  R68: Value: 4K7
  R78: Value: 330R
  R80-R82 R98: Value: 10K
  R90 R91: Value: 270R
  R96: Value: 22K
  R99: Value: 10R
R17-R31 R33-R40 R42-R48 = Res1: 0805; Manufacturer: Yageo; Manufacturer Part Number: RC0805JR-07560KL; Tolerance: ±5%; Power (Watts): 0.125W, 1/8W; Temperature Coefficient: ±100ppm/°C; Published: 8-Jun-2000; LatestRevisionDate: 17-Jul-2002; LatestRevisionNote: Re-released for DXP Platform.; PackageReference: AXIAL-0.3; Publisher: Altium Limited; Supplier 1: Digi-Key; RoHS: RoHS Compliant; Category: Resistors; Stock 1: 28428; Pricing 1: 1=0.14, 10=0.024, 25=0.0172, 100=0.0099, 250=0.00752, 500=0.006, 1000=0.00441, 2500=0.00383 (AUD); Packaging: Cut Tape (CT); Resistance (Ohms): 560k; Composition: Thick Film; Features: Moisture Resistant; Operating Temperature: -55°C ~ 155°C; Package / Case: 0805 (2012 Metric); Supplier Device Package: 0805; Size / Dimension: 0.079" L x 0.049" W (2.00mm x 1.25mm); Height: 0.024" (0.60mm); Number of Terminations: 2; ComponentLink1URL: http://www.yageo.com/documents/recent/PYu-RC_Group_51_RoHS_L_04.pdf; ComponentLink1Description: http://www.yageo.com/documents/recent/PYu-RC_Group_51_RoHS_L_04.pdf; Supplier 2: Digi-Key; Stock 2: 6550; Pricing 2: 1=0.88, 50=0.3502, 100=0.2701, 250=0.21008, 500=0.14806, 1000=0.10804 (AUD); ComponentLink2URL: http://media.digikey.com/pdf/Data%20Sheets/Panasonic%20Electronic%20Components/ERA%201A,2A,3A,6A,8A.pdf; ComponentLink2Description: http://media.digikey.com/pdf/Data%20Sheets/Panasonic%20Electronic%20Components/ERA%201A,2A,3A,6A,8A.pdf
  R17-R23 R25-R31 R33-R40 R42 R44-R47: Value: 560k
  R24 R48: Value: 560k; Supplier 3: Digi-Key; Stock 3: 6550; Pricing 3: 1=0.88, 50=0.3502, 100=0.2701, 250=0.21008, 500=0.14806, 1000=0.10804 (AUD)
R32 R41 R49 R58 R59 R83-R85 = Res1: 0805; Manufacturer: Panasonic Electronic Components; Manufacturer Part Number: ERJ-6GEYJ473V; Tolerance: ±5%; Power (Watts): 0.125W, 1/8W; Temperature Coefficient: ±200ppm/°C; Published: 8-Jun-2000; LatestRevisionDate: 17-Jul-2002; LatestRevisionNote: Re-released for DXP Platform.; PackageReference: AXIAL-0.3; Publisher: Altium Limited; Value: 47k; Supplier 1: Digi-Key; RoHS: RoHS Compliant; Category: Resistors; Stock 1: 309637; Pricing 1: 1=0.14, 50=0.021, 100=0.0154, 250=0.0118, 500=0.00946, 1000=0.00696 (AUD); Packaging: Cut Tape (CT); Resistance (Ohms): 47k; Composition: Thick Film; Features: Automotive AEC-Q200; Operating Temperature: -55°C ~ 155°C; Package / Case: 0805 (2012 Metric); Supplier Device Package: 0805; Size / Dimension: 0.079" L x 0.049" W (2.00mm x 1.25mm); Height: 0.028" (0.70mm); Number of Terminations: 2; ComponentLink1URL: http://industrial.panasonic.com/www-cgi/jvcr13pz.cgi?E+PZ+3+AOA0001+ERJ6GEYJ473V+7+WW; ComponentLink1Description: http://industrial.panasonic.com/www-cgi/jvcr13pz.cgi?E+PZ+3+AOA0001+ERJ6GEYJ473V+7+WW
R51-R57 R79 = Res1: 0805; Manufacturer: Panasonic Electronic Components; Manufacturer Part Number: ERJ-6GEYJ103V; Tolerance: ±5%; Power (Watts): 0.125W, 1/8W; Temperature Coefficient: ±200ppm/°C; Published: 8-Jun-2000; LatestRevisionDate: 17-Jul-2002; LatestRevisionNote: Re-released for DXP Platform.; PackageReference: AXIAL-0.3; Publisher: Altium Limited; Value: 10k; Supplier 1: Digi-Key; RoHS: RoHS Compliant; Category: Resistors; Stock 1: 2222214; Pricing 1: 1=0.14, 50=0.021, 100=0.0154, 250=0.0118, 500=0.00946, 1000=0.00696 (AUD); Packaging: Cut Tape (CT); Resistance (Ohms): 10k; Composition: Thick Film; Features: Automotive AEC-Q200; Operating Temperature: -55°C ~ 155°C; Package / Case: 0805 (2012 Metric); Supplier Device Package: 0805; Size / Dimension: 0.079" L x 0.049" W (2.00mm x 1.25mm); Height: 0.028" (0.70mm); Number of Terminations: 2; ComponentLink1URL: http://industrial.panasonic.com/www-cgi/jvcr13pz.cgi?E+PZ+3+AOA0001+ERJ6GEYJ103V+7+WW; ComponentLink1Description: http://industrial.panasonic.com/www-cgi/jvcr13pz.cgi?E+PZ+3+AOA0001+ERJ6GEYJ103V+7+WW
R70-R77 R88 = Res3: 0805; Published: 8-Jun-2000; LatestRevisionDate: 04-Mar-2005; LatestRevisionNote: PCB Footprint replaced.; PackageReference: J1-0603; Publisher: Altium Limited
  R70-R77: Value: 4k7
  R88: Value: 47K
R89 = Res1: 1k; Published: 8-Jun-2000; LatestRevisionDate: 17-Jul-2002; LatestRevisionNote: Re-released for DXP Platform.; PackageReference: AXIAL-0.3; Publisher: Altium Limited
TH1-TH8 = Res Thermal: Thermistor; Published: 24-Mar-1999; LatestRevisionDate: 04-Mar-2005; LatestRevisionNote: PCB Footprint replaced.; PackageReference: 6-0805; Publisher: Altium Limited
U1 = ATmega8-16AC: 8-Bit AVR Microcontroller with 8K Bytes of In-System Programmable Flash Memory; Published: 17-Sep-2003; LatestRevisionDate: 13-Apr-2006; LatestRevisionNote: IPC-7351 Footprint Added.; DatasheetVersion: 2486H-AVR-09/02; PackageVersion: revB, Oct-2001; PackageReference: 32A; Publisher: Altium Limited; PackageDescription: 32-Pin Thin Quad Flat Pack 0.8 mm Pitch; Code_JEDEC: MS-026-ABA; ComponentLink1Description: Manufacturer Link; ComponentLink1URL: http://www.atmel.com; ComponentLink2Description: Datasheet; ComponentLink2URL: http://www.atmel.com/dyn/resources/prod_documents/doc2486.pdf
U5 = AT90S2343-10SI: Isolated CAN transceiver; Manufacturer: Texas Instruments; Manufacturer Part Number: ISO1050DUBR; Number of Drivers/Receivers: 1/1; Duplex: Half; Receiver Hysteresis: 150mV; Data Rate: 1Mbps; Voltage - Supply: 3 V ~ 5.5 V; Published: 17-Sep-2003; LatestRevisionDate: 13-Apr-2006; LatestRevisionNote: IPC-7351 Footprint Added.; DatasheetVersion: 1004D-09/01; PackageVersion: revB, May-2002; PackageReference: 8S2; Publisher: Altium Limited; PackageDescription: 8-Pin Small Outline Package 1.27 mm Pitch; ComponentLink1Description: Manufacturer Link; ComponentLink1URL: http://www.atmel.com; ComponentLink2Description: Datasheet; ComponentLink2URL: http://www.atmel.com/dyn/resources/prod_documents/doc1004.pdf; Supplier 1: Digi-Key; RoHS: RoHS Compliant; Category: Integrated Circuits (ICs); Stock 1: 6471; Pricing 1: 1=6.31, 10=5.665, 100=4.647 (AUD); Packaging: Cut Tape (CT); Type: Transceiver; Protocol: CAN; Operating Temperature: -55°C ~ 105°C; Mounting Type: Surface Mount; Package / Case: 8-SMD, Gull Wing; Supplier Device Package: 8-SOP; ComponentLink3URL: http://www.ti.com/lit/ds/symlink/iso1050.pdf; ComponentLink3Description: http://www.ti.com/lit/ds/symlink/iso1050.pdf
U6 U7 = MC33174D: Low-Power Quad Bipolar Operational Amplifier; Manufacturer: STMicroelectronics; Manufacturer Part Number: MC33174DT; Amplifier Type: General Purpose; Number of Circuits: 4; Slew Rate: 2 V/µs; Gain Bandwidth Product: 2.1MHz; Current - Input Bias: 20nA; Voltage - Input Offset: 1mV; Current - Supply: 220µA; Current - Output / Channel: 27mA; Voltage - Supply, Single/Dual (±): 4 V ~ 44 V, ±2 V ~ 22 V; Published: 24-Aug-2001; LatestRevisionDate: 13-Apr-2006; LatestRevisionNote: IPC-7351 Footprint Added.; DatasheetVersion: Dec-1997; PackageVersion: Sep-1998; PackageReference: SO14; Publisher: Altium Limited; PackageDescription: 14-Pin Small Outline Integrated Circuit 1.27 mm Pitch; Code_IPC: SOIC127P600-14; ComponentLink1Description: Manufacturer Link; ComponentLink1URL: http://www.st.com/; ComponentLink2Description: Datasheet; ComponentLink2URL: http://www.st.com/stonline/products/literature/ds/2180/mc33174.pdf; Supplier 1: Digi-Key; RoHS: RoHS Compliant; Category: Integrated Circuits (ICs); Stock 1: 2093; Pricing 1: 1=1.18, 10=1.036, 100=0.7921, 500=0.62762, 1000=0.5027 (AUD); Packaging: Cut Tape (CT); Output Type: -; -3db Bandwidth: -; Operating Temperature: -40°C ~ 105°C; Mounting Type: Surface Mount; Package / Case: 14-SOIC (0.154", 3.90mm Width); Supplier Device Package: 14-SO; ComponentLink3URL: http://www.st.com/content/ccc/resource/technical/document/datasheet/2e/90/c8/0c/79/aa/43/e1/CD00000477.pdf/files/CD00000477.pdf/jcr:content/translations/en.CD00000477.pdf; ComponentLink3Description: http://www.st.com/content/ccc/resource/technical/document/datasheet/2e/90/c8/0c/79/aa/43/e1/CD00000477.pdf/files/CD00000477.pdf/jcr:content/translations/en.CD00000477.pdf
U10-U19 U21 = Optoisolator1: 4-Pin Phototransistor Optocoupler; Manufacturer: Vishay Semiconductor Opto Division; Manufacturer Part Number: TCMT1600; Number of Channels: 1; Voltage - Isolation: 3750Vrms; Current Transfer Ratio (Min): 80% @ 5mA; Current Transfer Ratio (Max): 300% @ 5mA; Turn On / Turn Off Time (Typ): 6µs, 5µs; Rise / Fall Time (Typ): 3µs, 4.7µs; Input Type: AC, DC; Voltage - Output (Max): 70V; Current - Output / Channel: 50mA; Voltage - Forward (Vf) (Typ): 1.35V; Current - DC Forward (If) (Max): 60mA; Vce Saturation (Max): 300mV; Published: 24-Mar-1999; LatestRevisionDate: 04-Mar-2005; LatestRevisionNote: Sch pins 3 & 4 Swapped.; DatasheetDocument: Nov-2003; PackageReference: DIP-4; Publisher: Altium Limited; Supplier 1: Digi-Key; RoHS: RoHS Compliant; Category: Isolators; Pricing 1: 1=1.12, 10=0.864, 25=0.718, 100=0.6172, 250=0.53864, 500=0.4713, 750=0.41521, 1000=0.37031 (AUD); Packaging: Cut Tape (CT); Output Type: Transistor; Operating Temperature: -40°C ~ 100°C; Mounting Type: Surface Mount; Package / Case: 4-SOIC (0.173", 4.40mm); Supplier Device Package: 4-SOP; ComponentLink1URL: http://www.vishay.com/docs/83512/tcmt1600.pdf; ComponentLink1Description: http://www.vishay.com/docs/83512/tcmt1600.pdf
  U10 U11 U15-U19 U21: Stock 1: 15783
  U12-U14: Stock 1: 15883
U20 = AD539KN: Wideband Dual-Channel Linear Multiplier/Divider; Manufacturer: NXP Semiconductors; Manufacturer Part Number: 74HC4051D,653; Multiplexer/Demultiplexer Circuit: 8:1; Number of Circuits: 1; On-State Resistance (Max): 120 Ohm; Channel-to-Channel Matching (&Delta;Ron): 6 Ohm; Voltage - Supply, Single (V+): 2 V ~ 10 V; Voltage - Supply, Dual (V±): ±1.5 V ~ 5 V; Switch Time (Ton, Toff) (Max): 51ns, 42ns; -3db Bandwidth: 180MHz; Channel Capacitance (CS(off), CD(off)): 3.5pF; Current - Leakage (IS(off)) (Max): 400nA; Published: 8-Jun-2000; LatestRevisionDate: 04-Mar-2005; LatestRevisionNote: Stylized 3D Model Added.; DatasheetVersion: REV.A 1998; PackageVersion: revC; PackageReference: N-16_B; Publisher: Altium Limited; PackageDescription: DIP; 16 Leads; Row Spacing 7.62 mm; Pitch 2.54 mm; ComponentLink1Description: Manufacturer Link; ComponentLink1URL: http://www.analog.com/en/prod/0%2C2877%2CAD539%2C00.html; ComponentLink2Description: Datasheet; ComponentLink2URL: http://www.analog.com/UploadedFiles/Data_Sheets/533994331AD539_a.pdf; Supplier 1: Digi-Key; RoHS: RoHS Compliant; Category: Integrated Circuits (ICs); Stock 1: 22816; Pricing 1: 1=0.63, 10=0.51, 100=0.3475, 500=0.2601, 1000=0.19481 (AUD); Packaging: Digi-Reel®; Switch Circuit: -; Charge Injection: -; Crosstalk: -; Operating Temperature: -40°C ~ 125°C (TA); Package / Case: 16-SOIC (0.154", 3.90mm Width); Supplier Device Package: 16-SO; ComponentLink3URL: http://www.nxp.com/documents/data_sheet/74HC_HCT4051.pdf; ComponentLink3Description: http://www.nxp.com/documents/data_sheet/74HC_HCT4051.pdf
VR1 = IFX25401TE V50: IC REG LDO 5V 0.4A TO252-5; Manufacturer: Infineon Technologies; Regulator Topology: Positive Fixed; Current - Output: 400mA; Voltage - Dropout (Typical): 0.25V @ 250mA; Number of Regulators: 1; Voltage - Input: 5.5 V ~ 40 V; Supplier 1: Digi-Key; Manufacturer Part Number: IFX25401TE V50; RoHS: RoHS Compliant; Category: Integrated Circuits (ICs); Stock 1: 4128; Pricing 1: 1=1.48, 10=1.325, 100=1.0328, 500=0.85324, 1000=0.6736 (AUD); Packaging: Cut Tape (CT); Voltage - Output: 5V; Current - Limit (Min): 400mA; Operating Temperature: -40°C ~ 125°C; Mounting Type: Surface Mount; Package / Case: TO-252-5, DPak (4 Leads + Tab), TO-252AD; Supplier Device Package: PG-TO252-5; ComponentLink1URL: http://www.infineon.com/dgdl/Infineon-IFX25401-DS-v01_02-en.pdf?folderId=db3a30431ff988150120802bce1d257a&fileId=db3a304320d39d590120f62a690569f7&ack=t; ComponentLink1Description: http://www.infineon.com/dgdl/Infineon-IFX25401-DS-v01_02-en.pdf?folderId=db3a30431ff988150120802bce1d257a&fileId=db3a304320d39d590120f62a690569f7&ack=t
VR2 = MC78M05BDTRK: Three-Terminal Medium Current Positive Voltage Regulator; Manufacturer: ON Semiconductor; Manufacturer Part Number: MC78M05CDTRKG; Note: Pin 2 is electrically connected to Pin 4; Pin 2 is trimmed and not drawn;; Regulator Topology: Positive Fixed; Voltage - Output: 5V; Current - Output: 500mA; Voltage - Dropout (Typical): 2V @ 350mA; Number of Regulators: 1; Voltage - Input: Up to 35V; Published: 15-Apr-2002; DatasheetVersion: Apr-2000; PackageVersion: 1997; PackageReference: 369A-13; Publisher: Altium Limited; PackageDescription: D-PAK/TO-252-AA; 3 Leads (1 Cropped); Body 10.3 (inc. leads) x 6.7 mm (LxW max); ComponentLink1Description: Manufacturer Link; ComponentLink1URL: http://www.onsemi.com/site/products/taxonomy/0,4438,503,00.html; ComponentLink2Description: Datasheet; ComponentLink2URL: http://www.onsemi.com/pub/Collateral/MC78M00-D.PDF; Supplier 1: Digi-Key; RoHS: RoHS Compliant; Category: Integrated Circuits (ICs); Stock 1: 29659; Pricing 1: 1=0.62, 10=0.531, 100=0.3968, 500=0.31168, 1000=0.24029 (AUD); Packaging: Cut Tape (CT); Current - Limit (Min): -; Operating Temperature: 0°C ~ 125°C; Mounting Type: Surface Mount; Package / Case: TO-252-3, DPak (2 Leads + Tab), SC-63; Supplier Device Package: DPAK-3; ComponentLink3URL: http://www.onsemi.com/pub_link/Collateral/MC78M00-D.PDF; ComponentLink3Description: http://www.onsemi.com/pub_link/Collateral/MC78M00-D.PDF
Y1 = XTAL: Crystal Oscillator; Manufacturer: Abracon LLC; Manufacturer Part Number: ABLS-16.000MHZ-D-4-T; Frequency Stability: ±50ppm; Frequency Tolerance: ±30ppm; Load Capacitance: 18pF; ESR (Equivalent Series Resistance): 40 Ohm; Operating Mode: Fundamental; Published: 8-Jun-2000; LatestRevisionDate: 17-Jul-2002; LatestRevisionNote: Re-released for DXP Platform.; PackageReference: R38; Publisher: Altium Limited; Supplier 1: Digi-Key; RoHS: RoHS Compliant; Category: Crystals and Oscillators; Stock 1: 9424; Pricing 1: 1=0.32, 10=0.274, 50=0.2452, 100=0.2182, 500=0.2078 (AUD); Packaging: Cut Tape (CT); Type: MHz Crystal; Frequency: 16MHz; Operating Temperature: -40°C ~ 85°C; Ratings: -; Mounting Type: Surface Mount; Package / Case: HC49/US; Size / Dimension: 0.449" L x 0.185" W (11.40mm x 4.70mm); Height: 0.165" (4.20mm); ComponentLink1URL: http://www.abracon.com/Resonators/abls.pdf; ComponentLink1Description: http://www.abracon.com/Resonators/abls.pdf